# EAGLE schematic antenna (EAGLE 7.5.0)
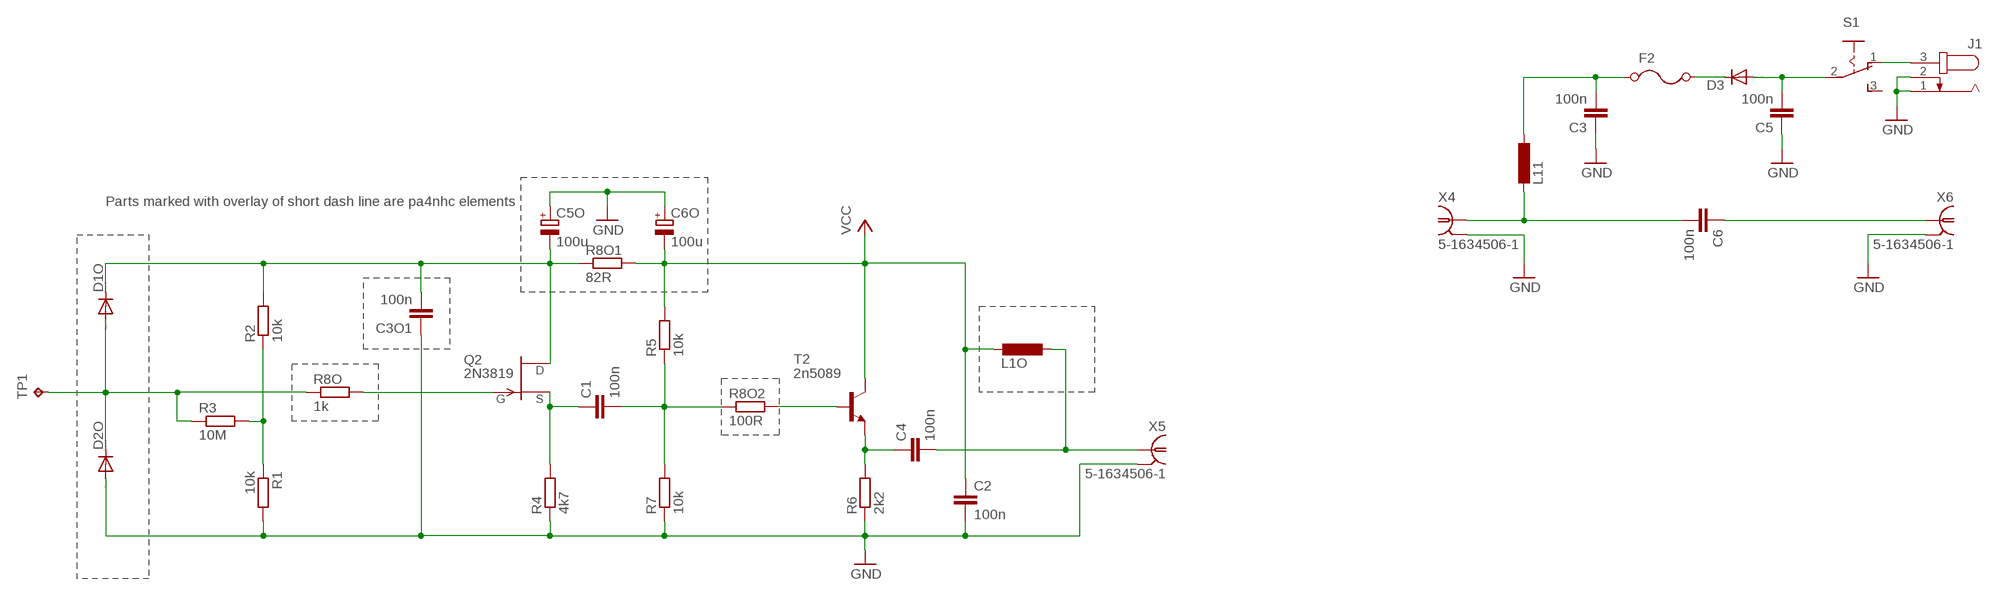
[diagram p0: schematic, sheet 1]

## Parts
C1  100n  C-EUC0805  [C0805]
C2  100n  C-EUC0805  [C0805]
C3  100n  C-EUC0805  [C0805]
C3O1  100n  C-EUC0805  [C0805]
C4  100n  C-EUC0805  [C0805]
C5  100n  C-EUC0805  [C0805]
C5O  100u  CPOL-EUE2.5-7  [E2,5-7]
C6  100n  C-EUC0805  [C0805]
C6O  100u  CPOL-EUE2.5-7  [E2,5-7]
D1O  DIODE-DO214AC  [DO214AC]
D2O  DIODE-DO214AC  [DO214AC]
D3  DIODE-DO214AC  [DO214AC]
F2  0ZCG0150BF2C  [CN1812]
J1  JACK-PLUG0  [SPC4077]
L1O  L-EU0207/5V  [0207/5V]
L11  L-EU0207/5V  [0207/5V]
Q2  2N3819  [TO92]
R1  10k  R-EU_M0805  [M0805]
R2  10k  R-EU_M0805  [M0805]
R3  10M  R-EU_M0805  [M0805]
R4  4k7  R-EU_M0805  [M0805]
R5  10k  R-EU_M0805  [M0805]
R6  2k2  R-EU_R2010  [R2010]
R7  10k  R-EU_M0805  [M0805]
R8O  1k  R-EU_M0805  [M0805]
R8O1  82R  R-EU_M0805  [M0805]
R8O2  100R  R-EU_M1206  [M1206]
S1  255SB  [255SB]
T2  2n5089  -NPN-SOT23-EBC  [SOT23-EBC]
TP1  copper plate  TPTP20SQ  [TP20SQ]
X4  5-1634506-1  [5-1634506-1]
X5  5-1634506-1  [5-1634506-1]
X6  5-1634506-1  [5-1634506-1]

## Nets
GND: C2.2 C3.1 C3O1.1 C5.1 C5O.+ C6O.+ D2O.A J1.1 J1.2 R1.2 R4.1 R6.1 R7.1 X4.2 X4.3 X4.4 X4.5 X5.2 X5.3 X5.4 X5.5 X6.2 X6.3 X6.4 X6.5
N$1: D1O.A D2O.C R3.1 R8O.1 TP1.TP
N$2: R1.1 R2.1 R3.2
N$3: C1.1 Q2.3(S) R4.2
N$4: Q2.2(G) R8O.2
N$5: C4.1 R6.2 T2.E
N$6: C4.2 L1O.1 X5.1
N$7: C6.2 L11.2 X4.1
N$8: J1.3 S1.1(O)
N$9: C3O1.2 C5O.- D1O.C Q2.1(D) R2.2 R8O1.1
N$10: R8O2.2 T2.B
N$11: C1.2 R5.1 R7.2 R8O2.1
N$12: C3.2 F2.P$1 L11.1
N$13: D3.C F2.P$2
N$14: C5.2 D3.A S1.2(P)
N$15: C6.1 X6.1
VCC: C2.1 C6O.- L1O.2 R5.2 R8O1.2 T2.C
Unconnected: S1.3(S)

## Notes on the sheet
- Parts marked with overlay of short dash line are pa4nhc elements

## Library data of the parts
C1-C3 C3O1 C4-C6 = rcl:C-EU: CAPACITOR, European symbol; MFR: C0805C104K5RACTU
C5O C6O = rcl:CPOL-EU: POLARIZED CAPACITOR, European symbol; MFR: 107CKS035M
D1O D2O = diode:DIODE-: DIODE; MFR: FM4007W-W
D3 = diode:DIODE-: DIODE; MFR: SSA33L-E3/5AT
F2 = lstolcman_thesis:0ZCG0150BF2C; MFR: 0ZCG0150BF2C; MFR2: 0ZCJ0020FF2E
J1 = con-jack:JACK-PLUG: DC POWER JACK Power Jack, DC, Right Angle, Through Hole, Rated 5A at 16VDC, PC Terminals Distributor: Farnell (www.Farnell.de) Drawing: 84N1161.pdf / 84N1162.pdf Manufacturer: SPC Technology (www.spctechnology.com) Type: SPC4077 / SPC 4078; MFR: FC68148; OC_FARNELL: unknown; OC_NEWARK: unknown; SUP: tme
L1O L11 = rcl:L-EU: INDUCTOR, European symbol; MFR: RLB0914-101KL
Q2 = transistor-fet:2N3819: N-Channel Junction FET; MFR: 2N3819 or 2N4859
R1 R2 R5 R7 = rcl:R-EU_: RESISTOR, European symbol; MFR: AS08J1002ET
R3 = rcl:R-EU_: RESISTOR, European symbol; MFR: SG73S2ATTD106J
R4 = rcl:R-EU_: RESISTOR, European symbol; MFR: SG73S2ATTD472J
R6 = rcl:R-EU_: RESISTOR, European symbol; MFR: SG73P2ATTD222J
R8O = rcl:R-EU_: RESISTOR, European symbol; MFR: AS08J1001ET
R8O1 = rcl:R-EU_: RESISTOR, European symbol; MFR: SG73S2ATTD820J
R8O2 = rcl:R-EU_: RESISTOR, European symbol; MFR: AS08J1000ET
S1 = switch:255SB: SLIDING SWITCH Distributor Buerklin, 11G810; MFR: S1501; SUP: tme
T2 = transistor:*-NPN-: NPN Transistror BF959 corrected 2008.03.06; MFR: MMBT5089LT1G or 2N5109 or 2N3866
TP1 = testpad:TP: Test pad; MFR: LHL08TB100K
X4-X6 = lstolcman_thesis:5-1634506-1: BNC CONNECTOR M/A COM www.macom.com; MFR: 5-1634506-1